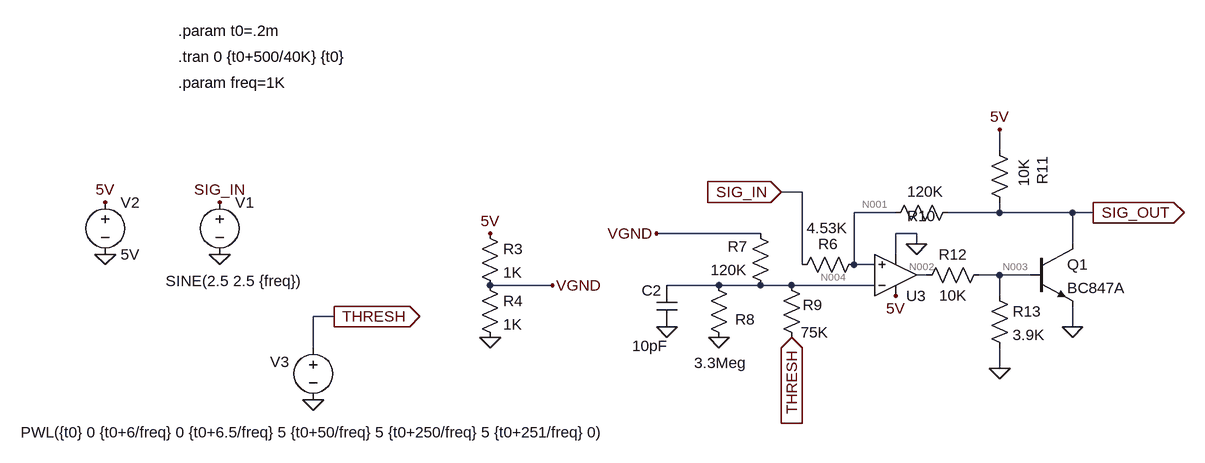
[diagram p0: schematic schmitt.asc]
schmitt.asc, the LTspice schematic file:
Version 4
SHEET 1 880 680
WIRE 336 0 336 -32
WIRE 32 64 0 64
WIRE 176 96 112 96
WIRE 336 96 336 80
WIRE 336 96 256 96
WIRE 448 96 336 96
WIRE 480 96 448 96
WIRE -32 128 -192 128
WIRE 208 128 176 128
WIRE 208 144 208 128
WIRE 448 144 448 96
WIRE 176 160 176 128
WIRE 32 176 32 64
WIRE 112 176 112 96
WIRE 144 176 112 176
WIRE 224 192 208 192
WIRE 336 192 304 192
WIRE 384 192 336 192
WIRE -352 208 -448 208
WIRE -96 208 -176 208
WIRE -32 208 -96 208
WIRE 16 208 -32 208
WIRE 144 208 16 208
WIRE 336 224 336 192
WIRE -688 256 -720 256
WIRE 448 272 448 240
WIRE -720 304 -720 256
WIRE 336 336 336 304
WIRE 336 336 320 336
FLAG -1040 80 5V
FLAG -1040 160 0
FLAG -448 288 0
FLAG -448 128 5V
FLAG -352 208 VGND
FLAG -688 256 THRESH
IOPIN -688 256 Out
FLAG -720 384 0
FLAG -176 272 0
FLAG -96 288 0
FLAG 16 288 THRESH
IOPIN 16 288 In
FLAG 176 224 5V
FLAG 208 144 0
FLAG 336 -32 5V
FLAG 336 336 0
FLAG 448 272 0
FLAG 480 96 SIG_OUT
IOPIN 480 96 Out
FLAG 0 64 SIG_IN
IOPIN 0 64 In
FLAG -192 128 VGND
FLAG -864 80 SIG_IN
FLAG -864 160 0
SYMBOL voltage -1040 64 R0
WINDOW 123 0 0 Left 2
WINDOW 39 0 0 Left 2
SYMATTR InstName V2
SYMATTR Value 5V
SYMBOL res -464 112 R0
SYMATTR InstName R3
SYMATTR Value 1K
SYMBOL res -464 192 R0
SYMATTR InstName R4
SYMATTR Value 1K
SYMBOL voltage -720 288 R0
WINDOW 0 -66 38 Left 2
WINDOW 3 -450 146 Left 2
WINDOW 123 0 0 Left 2
WINDOW 39 0 0 Left 2
SYMATTR InstName V3
SYMATTR Value PWL({t0} 0 {t0+6/freq} 0 {t0+6.5/freq} 5 {t0+50/freq} 5 {t0+250/freq} 5 {t0+251/freq} 0)
SYMBOL res 16 192 R270
WINDOW 0 32 56 VTop 2
WINDOW 3 88 55 VBottom 2
SYMATTR InstName R6
SYMATTR Value 4.53K
SYMBOL res -16 224 R180
WINDOW 0 36 76 Left 2
WINDOW 3 36 40 Left 2
SYMATTR InstName R7
SYMATTR Value 120K
SYMBOL cap -160 272 R180
WINDOW 0 24 56 Left 2
WINDOW 3 14 -29 Left 2
SYMATTR InstName C2
SYMATTR Value 10pF
SYMBOL res -112 192 R0
WINDOW 0 41 68 Left 2
WINDOW 3 -22 135 Left 2
SYMATTR InstName R8
SYMATTR Value 3.3Meg
SYMBOL res 32 304 R180
WINDOW 0 -32 66 Left 2
WINDOW 3 -41 24 Left 2
SYMATTR InstName R9
SYMATTR Value 75K
SYMBOL res 272 80 R90
WINDOW 0 37 56 VBottom 2
WINDOW 3 -32 50 VTop 2
SYMATTR InstName R10
SYMATTR Value 120K
SYMBOL res 352 96 R180
WINDOW 0 -50 43 VRight 2
WINDOW 3 -21 40 VRight 2
SYMATTR InstName R11
SYMATTR Value 10K
SYMBOL npn 384 144 R0
SYMATTR InstName Q1
SYMATTR Value BC847A
SYMBOL res 320 176 R90
WINDOW 0 0 56 VBottom 2
WINDOW 3 32 56 VTop 2
SYMATTR InstName R12
SYMATTR Value 10K
SYMBOL res 320 208 R0
SYMATTR InstName R13
SYMATTR Value 3.9K
SYMBOL Opamps\\UniversalOpamp2 176 192 M180
SYMATTR InstName U3
SYMBOL voltage -864 64 R0
WINDOW 123 0 0 Left 2
WINDOW 39 0 0 Left 2
WINDOW 3 -83 137 Left 2
SYMATTR Value SINE(2.5 2.5 {freq})
SYMATTR InstName V1
TEXT -928 -104 Left 2 !.param freq=1K
TEXT -928 -184 Left 2 !.param t0=.2m
TEXT -928 -144 Left 2 !.tran 0 {t0+500/40K} {t0}

The netlist it stands for:
* schmitt.asc
V2 5V 0 5V
R3 5V VGND 1K
R4 VGND 0 1K
V3 THRESH 0 PWL({t0} 0 {t0+6/freq} 0 {t0+6.5/freq} 5 {t0+50/freq} 5 {t0+250/freq} 5 {t0+251/freq} 0)
R6 SIG_IN N001 4.53K
R7 N004 VGND 120K
C2 0 N004 10pF
R8 N004 0 3.3Meg
R9 THRESH N004 75K
R10 SIG_OUT N001 120K
R11 SIG_OUT 5V 10K
Q1 SIG_OUT N003 0 0 BC847A
R12 N003 N002 10K
R13 N003 0 3.9K
XU3 N001 N004 5V 0 N002 level.2 Avol=1Meg GBW=10Meg Slew=10Meg ilimit=25m rail=0 Vos=0 phimargin=45 en=0 enk=0 in=0 ink=0 Rin=500Meg  ; pins IN+ IN- V+ V- OUT
V1 SIG_IN 0 SINE(2.5 2.5 {freq})
.model NPN NPN
.model PNP PNP
.lib standard.bjt
.param freq=1K
.param t0=.2m
.tran 0 {t0+500/40K} {t0}
.lib UniversalOpamps2.sub
.backanno
.end

* Results of the author's LTspice run, read from the files saved beside the schematic
* Operating Point, zero values left out:
*   V(5v) = 5 V
*   V(vgnd) = 2.494 V
*   V(sig_in) = 2.5 V
*   V(n001) = 2.41 V
*   V(n004) = 946 mV
*   V(sig_out) = 13.63 mV
*   V(n003) = 670.3 mV
*   V(n002) = 4.995 V
*   Ic(Q1) = 518.6 µA
*   Ib(Q1) = 260.6 µA
*   Ie(Q1) = -779.2 µA
*   I(R13) = 171.9 µA
*   I(R12) = -432.5 µA
*   I(R11) = -498.6 µA
*   I(R10) = -19.97 µA
*   I(R9) = -12.61 µA
*   I(R8) = 286.7 nA
*   I(R7) = -12.9 µA
*   I(R6) = 19.97 µA
*   I(R4) = 2.494 mA
*   I(R3) = 2.506 mA
*   I(V1) = -19.97 µA
*   I(V3) = 12.61 µA
*   I(V2) = -3.438 mA
*   Ix(u3:1) = -180.9 pA
*   Ix(u3:2) = -3.108 nA
*   Ix(u3:3) = 433 µA
*   Ix(u3:4) = -598.8 nA
*   Ix(u3:5) = -432.5 µA
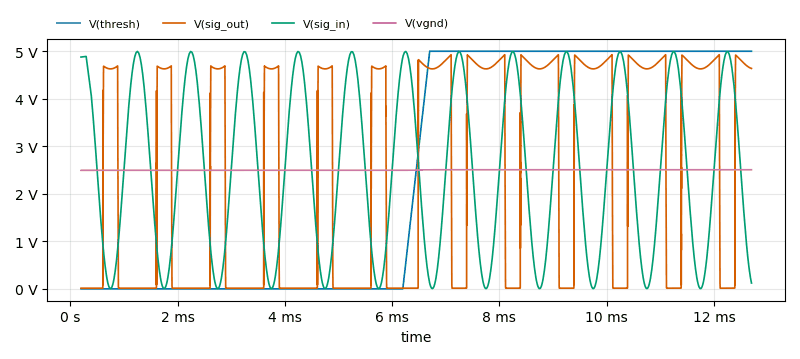
[diagram p1: Transient Analysis of schmitt.asc, plotted from the saved traces]
* Transient Analysis, 1 run:
*   V(thresh): min 0 V, max 5 V, average 2.5 V, rms 3.512 V, last 5 V
*   V(sig_out): min 13.44 mV, max 4.928 V, average 2.329 V, rms 3.297 V, last 4.637 V
*   V(sig_in): min 3.977 mV, max 4.996 V, average 2.517 V, rms 3.077 V, last 122.4 mV
*   V(vgnd): min 2.494 V, max 2.506 V, average 2.5 V, rms 2.5 V, last 2.506 V